# Altium schematic sheet 358LCD.SchDoc
size Legal; Author: Mark & Qiming; DocumentNumber: 10; SheetNumber: 9; SheetTotal: 9
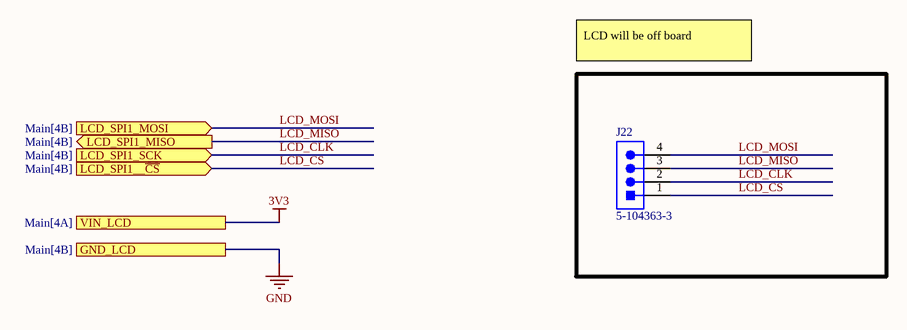
[diagram p0: 358LCD.SchDoc]

## Parts
J22  5-104363-3  [5-104363-3-Footprint-1]

## Ports
GND_LCD (see Main[4B]), LCD_SPI1__~{CS} (in, see Main[4B]), LCD_SPI1_MISO (out, see Main[4B]), LCD_SPI1_MOSI (in, see Main[4B]), LCD_SPI1_SCK (in, see Main[4B]), VIN_LCD (see Main[4A])

## Nets
3V3: port VIN_LCD
GND: port GND_LCD
LCD_~{CS}: J22.1 ; port LCD_SPI1__~{CS}
LCD_CLK: J22.2 ; port LCD_SPI1_SCK
LCD_MISO: J22.3 ; port LCD_SPI1_MISO
LCD_MOSI: J22.4 ; port LCD_SPI1_MOSI

## Notes on the sheet
- LCD will be off board
- Title:
- Desc:
- Size:
- Letter
- Auth:
- Proj:
- Sheet
- of
- www.seas.upenn.edu
- Electrical and Systems Engineering

## Library data of the parts
J22 = CMP-00105-2: Board Connector, 4 Contact(s), 1 Row(s), Male, Straight, 0.1 inch Pitch, Solder Terminal, Locking, Black Insulator, Plug